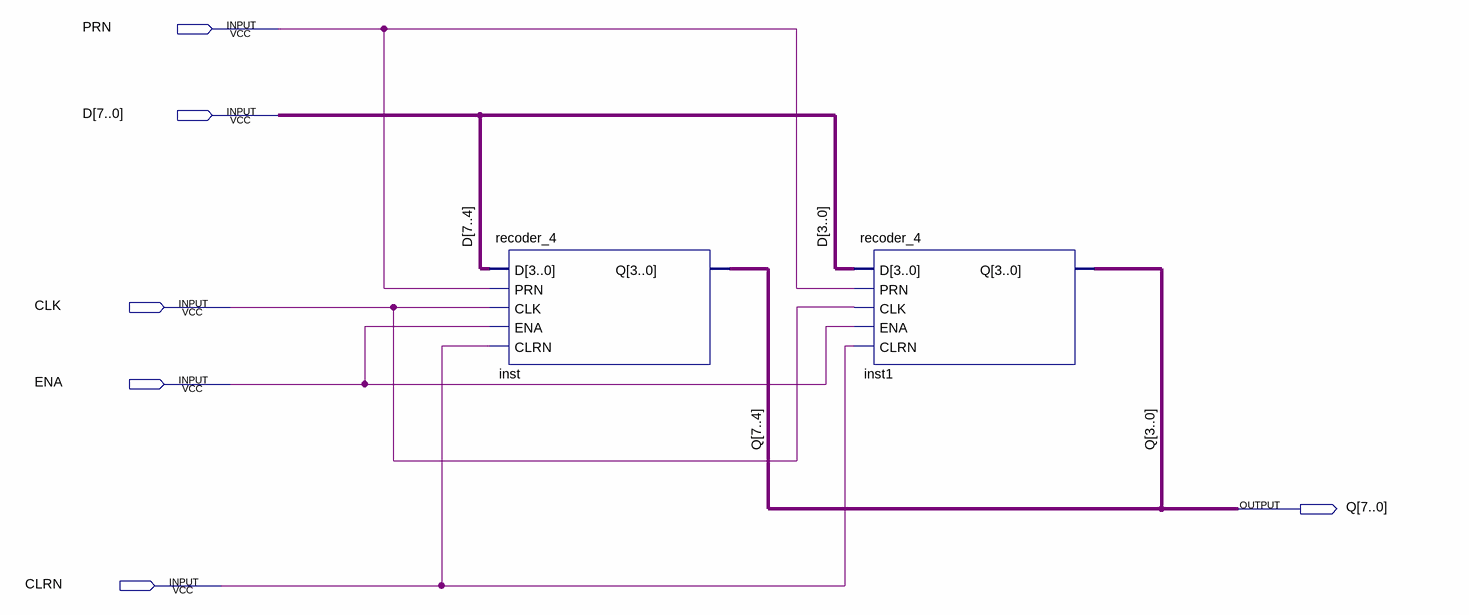
[diagram p0: schematic sheet]
// Quartus schematic recoder_8.bdf as structural Verilog: 2 symbols, 6 pins
module recoder_8 (
  input  PRN,
  input  [7:0] D,
  input  CLK,
  input  ENA,
  input  CLRN,
  output [7:0] Q
);

  recoder_4 inst (.D(D[7:4]), .PRN(PRN), .CLK(CLK), .ENA(ENA), .CLRN(CLRN), .Q(Q[7:4]));
  recoder_4 inst1 (.D(D[3:0]), .PRN(PRN), .CLK(CLK), .ENA(ENA), .CLRN(CLRN), .Q(Q[3:0]));
endmodule
